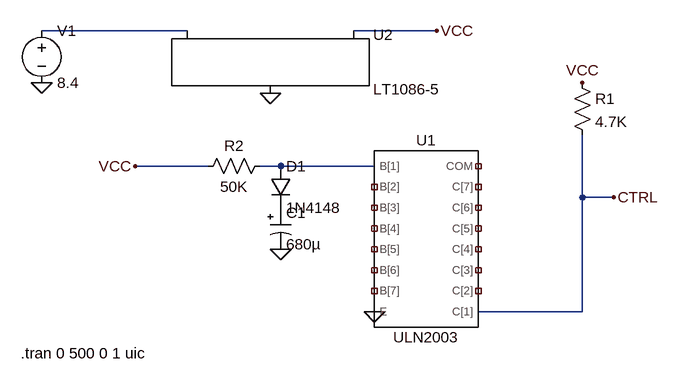
[diagram p0: schematic Draft3.asc]
Draft3.asc, the LTspice schematic file:
Version 4
SHEET 1 880 680
WIRE -208 -144 -432 -144
WIRE 176 -144 48 -144
WIRE -176 64 -288 64
WIRE -64 64 -96 64
WIRE 80 64 -64 64
WIRE 400 112 400 16
WIRE 448 112 400 112
WIRE 400 288 400 112
WIRE 400 288 240 288
FLAG -432 -64 0
FLAG -80 -48 0
FLAG 176 -144 VCC
FLAG -288 64 VCC
FLAG 400 -64 VCC
FLAG 80 288 0
FLAG 448 112 CTRL
FLAG -64 192 0
SYMBOL ULN2003 160 176 R0
SYMATTR InstName U1
SYMBOL PowerProducts\\LT1086-5 -80 -144 R0
SYMATTR InstName U2
SYMBOL voltage -432 -160 R0
WINDOW 123 0 0 Left 0
WINDOW 39 0 0 Left 0
SYMATTR InstName V1
SYMATTR Value 8.4
SYMBOL res 384 -80 R0
SYMATTR InstName R1
SYMATTR Value 4.7K
SYMBOL res -80 48 R90
WINDOW 0 0 56 VBottom 2
WINDOW 3 32 56 VTop 2
SYMATTR InstName R2
SYMATTR Value 50K
SYMBOL diode -80 64 R0
SYMATTR InstName D1
SYMATTR Value 1N4148
SYMBOL polcap -80 128 R0
WINDOW 3 24 56 Left 2
SYMATTR InstName C1
SYMATTR Value 680µ
SYMATTR Description Capacitor
SYMATTR Type cap
SYMATTR SpiceLine V=25 Irms=1.57 Rser=0.022 Lser=7.357n mfg="Würth Elektronik" pn="860080475018 WCAP-ATLI 10x20" type="Al electrolytic"
TEXT -464 352 Left 2 !.tran 0 500 0 1 uic

The netlist it stands for:
* Draft3.asc
XU1 N002 NC_01 NC_02 NC_03 NC_04 NC_05 NC_06 0 NC_07 NC_08 NC_09 NC_10 NC_11 NC_12 NC_13 CTRL ULN2003  ; pins B[1] B[2] B[3] B[4] B[5] B[6] B[7] E COM C[7] C[6] C[5] C[4] C[3] C[2] C[1]
XU2 0 VCC N001 LT1086-5
V1 N001 0 8.4
R1 VCC CTRL 4.7K
R2 N002 VCC 50K
D1 N002 P001 1N4148
C1 P001 0 680µ V=25 Irms=1.57 Rser=0.022 Lser=7.357n mfg="Würth Elektronik" pn="860080475018 WCAP-ATLI 10x20" type="Al electrolytic"
.model D D
.lib standard.dio
.tran 0 500 0 1 uic
.lib C:\Users\Parmeet Singh Ghai\Documents\GitHub\AutomatedLockSystem\LTSpice\ULN2003.lib
.backanno
.end

* Results of the author's LTspice run, read from the files saved beside the schematic
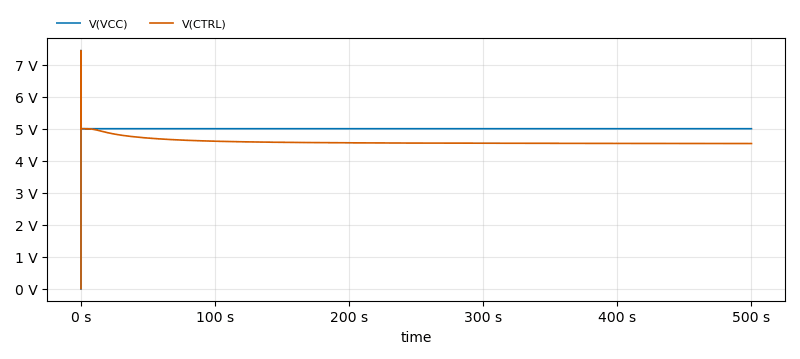
[diagram p1: Transient Analysis of Draft3.asc, plotted from the saved traces]
* Transient Analysis, 1 run:
*   V(VCC): min 0 V, max 7.45 V, average 5.002 V, rms 5.002 V, last 5.002 V
*   V(CTRL): min 0 V, max 7.435 V, average 4.594 V, rms 4.595 V, last 4.539 V